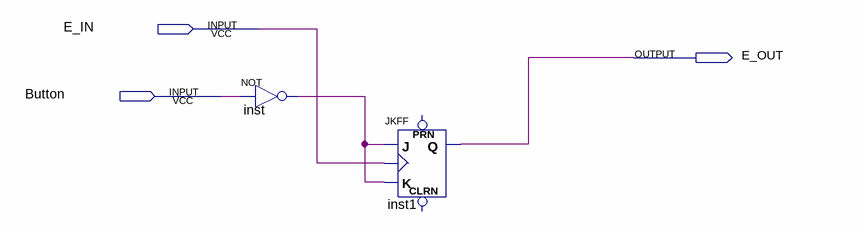
[diagram p0: schematic sheet]
// Quartus schematic enable.bdf as structural Verilog: 2 symbols, 3 pins
module enable (
  input  E_IN,
  input  Button,
  output E_OUT
);

  wire inst_out;

  not inst (inst_out, Button);
  JKFF inst1 (.K(inst_out), .J(inst_out), .CLK(E_IN), .Q(E_OUT));  // open: PRN, CLRN
endmodule
